# Altium project SWatch_1.PrjPcb
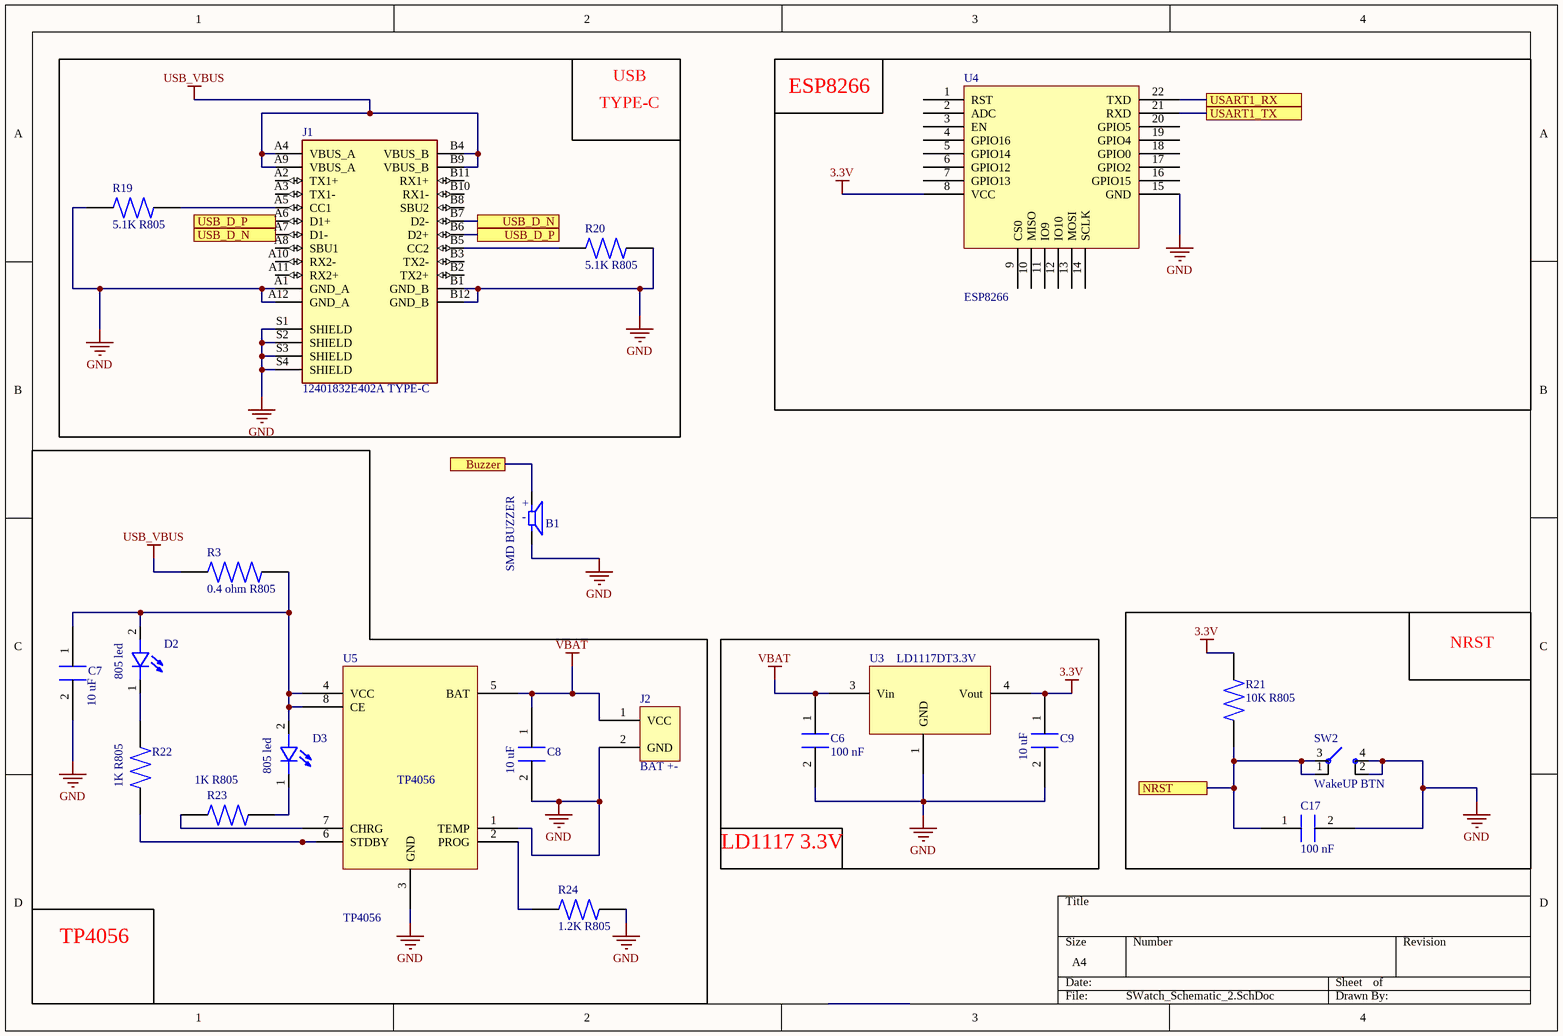
[diagram p0: SWatch_Schematic_2.SchDoc]
2 sheets, 57 parts. Net scope: flat (ports and power ports of the same name join across sheets).
Board file: PCB_SWatch_VER1.PcbDoc
Sheets:
  SWatch_Schematic_2.SchDoc
  SWatch_Schematic_1.SchDoc

## Sheet SWatch_Schematic_2.SchDoc
size A4

### Parts
B1  SMD BUZZER  [SMD BUZZER]
C6  100 nF  [100 nF C805]
C7  10 uF  [10uF C805]
C8  10 uF  [10uF C805]
C9  10 uF  [10uF C805]
C17  100 nF  [100 nF C805]
D2  805 led  [led]
D3  805 led  [led]
J1  12401832E402A TYPE-C  [12401832E402A TYPE-C]
J2  BAT +-  [BAT -+]
R3  0.4 ohm R805  [1K R805]
R19  5.1K R805  [1K R805]
R20  5.1K R805  [1K R805]
R21  10K R805  [10K R805]
R22  1K R805  [1K R805]
R23  1K R805  [1K R805]
R24  1.2K R805  [1.2K R805]
SW2  WakeUP BTN  [WakeUp BTN]
U3  LD1117DT3.3V  [LD1117DT3.3V]
U4  ESP8266  [ESP8266]
U5  TP4056  [TP4056]

### Blocks framed on the sheet
ESP8266: U4
TP4056: C7 C8 D2 D3 J2 R3 R22-R24 U5
NRST: C17 R21 SW2
LD1117 3.3V: C6 C9 U3

### Ports
  Buzzer, NRST, USART1_RX, USART1_TX, USB_D_N, USB_D_P

### Nets
3.3V: C9.1 R21.1 U3.4(Vout) U4.8(VCC)
GND: B1.2(N) C6.2 C7.2 C8.2 C9.2 C17.2 J1.A1(GND_A) J1.A12(GND_A) J1.B1(GND_B) J1.B12(GND_B) J1.S1(SHIELD) J1.S2(SHIELD) J1.S3(SHIELD) J1.S4(SHIELD) J2.2(GND) R19.1 R20.2 R24.2 SW2.2 SW2.4 U3.1(GND) U4.15(GND) U5.1(TEMP) U5.3(GND)
USB_VBUS: J1.A4(VBUS_A) J1.A9(VBUS_A) J1.B4(VBUS_B) J1.B9(VBUS_B) R3.2
VBAT: C6.1 C8.1 J2.1(VCC) U3.3(Vin) U5.5(BAT)
NetB1_1: B1.1(P) ; port   Buzzer
NetC7_1: C7.1 D2.2(A) D3.2(A) R3.1 U5.4(VCC) U5.8(CE)
NetC17_1: C17.1 R21.2 SW2.1 SW2.3 ; port NRST
NetD2_1: D2.1(C) R22.2
NetD3_1: D3.1(C) R23.2
NetJ1_A5: J1.A5(CC1) R19.2
NetJ1_A6: J1.A6(D1+) J1.B6(D2+) ; port USB_D_P
NetJ1_A7: J1.A7(D1-) J1.B7(D2-) ; port USB_D_N
NetJ1_B5: J1.B5(CC2) R20.1
NetR2_1: U4.22(TXD) ; port USART1_RX
NetR4_1: U4.21(RXD) ; port USART1_TX
NetR22_1: R22.1 U5.6(STDBY)
NetR23_1: R23.1 U5.7(CHRG)
NetR24_1: R24.1 U5.2(PROG)

Not connected (* = marked no-connect by the designer): J1 A2(TX1+) A3(TX1-) A8(SBU1) A10(RX2-) A11(RX2+) B2(TX2+) B3(TX2-) B8(SBU2) B10(RX1-) B11(RX1+); U4 1(RST) 2(ADC) 3(EN) 4(GPIO16) 5(GPIO14) 6(GPIO12) 7(GPIO13) 9(CS0) 10(MISO) 11(IO9) 12(IO10) 13(MOSI) 14(SCLK) 16(GPIO15) 17(GPIO2) 18(GPIO0) 19(GPIO4) 20(GPIO5)

### Notes on the sheet
- TYPE-C
- USB
- (in symbol SMD BUZZER) +; -

### Library data of the parts
B1 = SMD BUZZER: PKMCS0909E4000-R1

## Sheet SWatch_Schematic_1.SchDoc
size A4
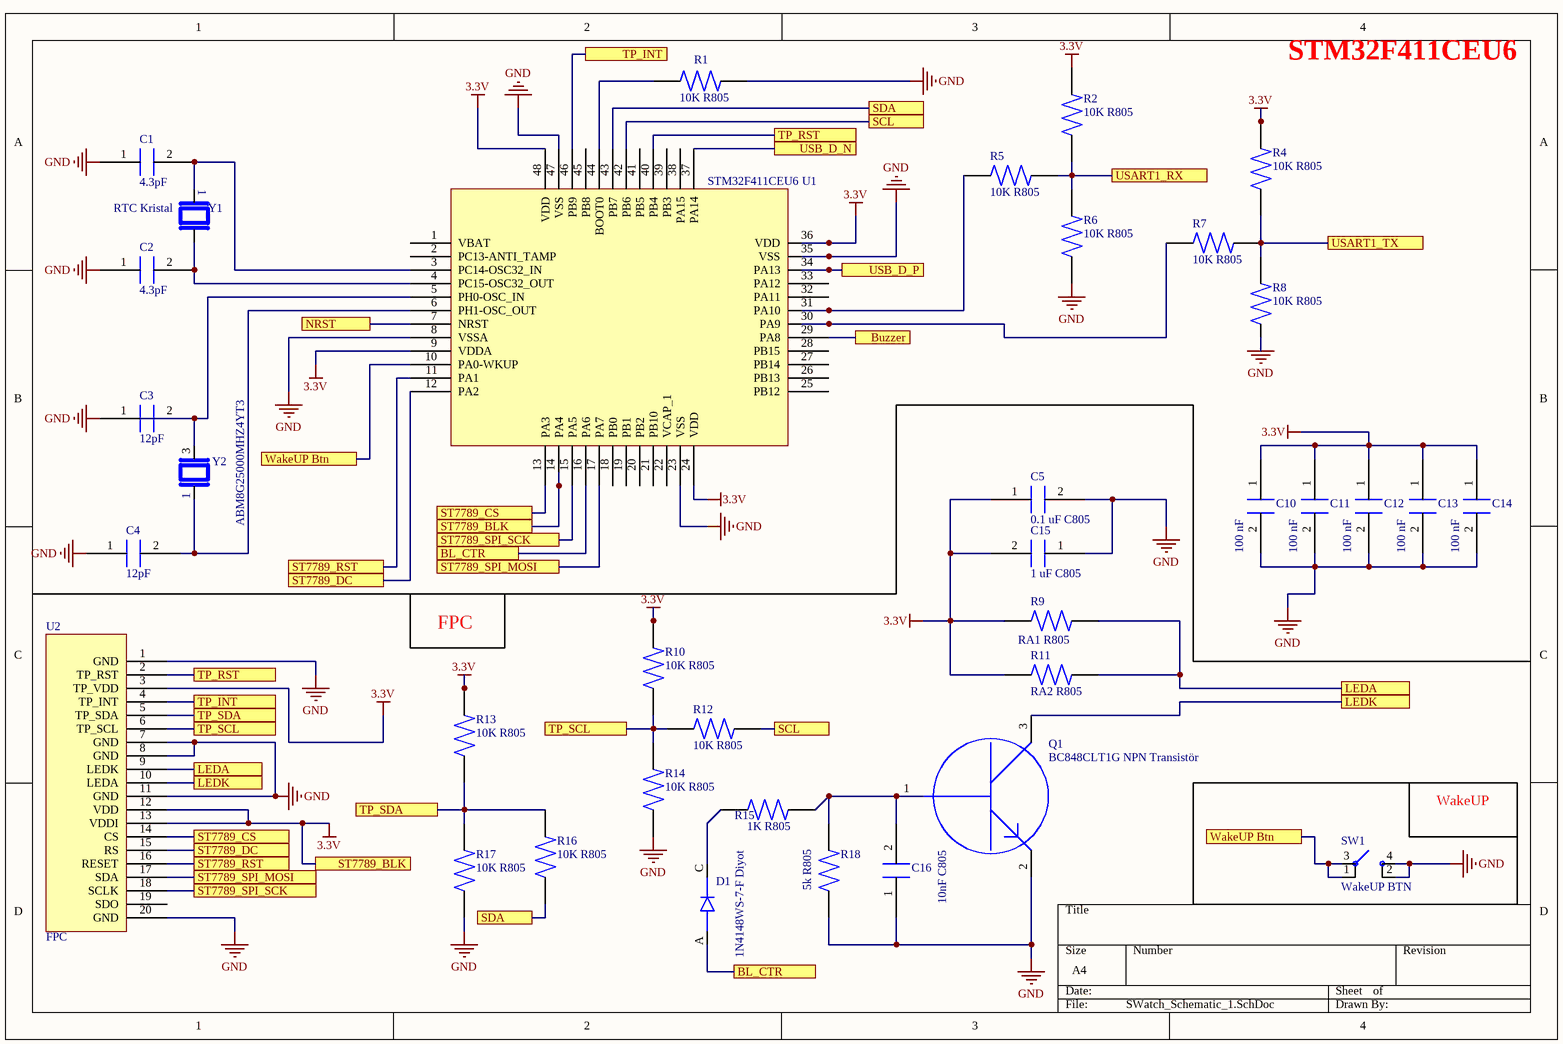
[diagram p1: SWatch_Schematic_1.SchDoc]

### Parts
C1  4.3pF  [4.3 pF C805]
C2  4.3pF  [4.3 pF C805]
C3  12pF  [12pF C805]
C4  12pF  [12pF C805]
C5  0.1 uF C805  [0.1 uF C805]
C10  100 nF  [100 nF C805]
C11  100 nF  [100 nF C805]
C12  100 nF  [100 nF C805]
C13  100 nF  [100 nF C805]
C14  100 nF  [100 nF C805]
C15  1 uF C805  [1 uF C805]
C16  10nF C805  [4.3 pF C805]
D1  1N4148WS-7-F Diyot  [1N4148WS-7-F Diyot]
Q1  BC848CLT1G NPN Transistör  [BC848CLT1G NPN Transistör]
R1  10K R805  [10K R805]
R2  10K R805  [10K R805]
R4  10K R805  [10K R805]
R5  10K R805  [10K R805]
R6  10K R805  [10K R805]
R7  10K R805  [10K R805]
R8  10K R805  [10K R805]
R9  RA1 R805  [1K R805]
R10  10K R805  [10K R805]
R11  RA2 R805  [1K R805]
R12  10K R805  [10K R805]
R13  10K R805  [10K R805]
R14  10K R805  [10K R805]
R15  1K R805  [1K R805]
R16  10K R805  [10K R805]
R17  10K R805  [10K R805]
R18  5k R805  [1.2K R805]
SW1  WakeUP BTN  [WakeUp BTN]
U1  STM32F411CEU6  [STM32F411CEU6]
U2  FPC  [FPC]
Y1  RTC Kristal  [32.768 KHZ RTC]
Y2  ABM8G25000MHZ4YT3  [ABM8G25000MHZ4YT3]

### Blocks framed on the sheet
WakeUP: SW1

### Ports
BL_CTR, Buzzer, LEDA, LEDK, NRST, SCL, SDA, ST7789_BLK, ST7789_CS, ST7789_DC, ST7789_RST, ST7789_SPI_MOSI, ST7789_SPI_SCK, TP_INT, TP_RST, TP_SCL, TP_SDA, USART1_RX, USART1_TX, USB_D_N, USB_D_P, WakeUP Btn

### Nets
3.3V: C5.1 C10.1 C11.1 C12.1 C13.1 C14.1 C15.2 R2.2 R4.2 R9.1 R10.2 R11.1 R13.2 U1.9(VDDA) U1.14(PA4) U1.24(VDD) U1.36(VDD) U1.48(VDD) U2.3(TP_VDD) U2.12(VDD) U2.13(VDDI) ; port ST7789_BLK
GND: C1.1 C2.1 C3.1 C4.1 C5.2 C10.2 C11.2 C12.2 C13.2 C14.2 C15.1 C16.1 Q1.2 R1.2 R6.1 R8.1 R14.1 R17.1 R18.1 SW1.2 SW1.4 U1.8(VSSA) U1.23(VSS) U1.35(VSS) U1.47(VSS) U2.1(GND) U2.7(GND) U2.8(GND) U2.11(GND) U2.20(GND)
NetB1_1: U1.29(PA8) ; port Buzzer
NetC1_2: C1.2 U1.3(PC14-OSC32_IN) Y1.1
NetC2_2: C2.2 U1.4(PC15-OSC32_OUT) Y1.2
NetC3_2: C3.2 U1.5(PH0-OSC_IN) Y2.3
NetC4_2: C4.2 U1.6(PH1-OSC_OUT) Y2.1
NetC16_2: C16.2 Q1.1 R15.2 R18.2
NetC17_1: U1.7(NRST) ; port NRST
NetD1_A: D1.A U1.16(PA6) ; port BL_CTR
NetD1_C: D1.C R15.1
NetJ1_A6: U1.34(PA13) ; port USB_D_P
NetJ1_A7: U1.37(PA14) ; port USB_D_N
NetQ1_3: Q1.3 U2.10(LEDA) ; port LEDK
NetR1_1: R1.1 U1.44(BOOT0)
NetR2_1: R2.1 R5.1 R6.2 ; port USART1_RX
NetR4_1: R4.1 R7.1 R8.2 ; port USART1_TX
NetR5_2: R5.2 U1.31(PA10)
NetR7_2: R7.2 U1.30(PA9)
NetR9_2: R9.2 R11.2 U2.9(LEDK) ; port LEDA
NetR10_1: R10.1 R12.2 R14.2 U2.6(TP_SCL) ; port TP_SCL
NetR12_1: R12.1 U1.42(PB6) ; port SCL
NetR13_1: R13.1 R16.2 R17.2 U2.5(TP_SDA) ; port TP_SDA
NetR16_1: R16.1 U1.43(PB7) ; port SDA
NetSW1_1: SW1.1 SW1.3 U1.10(PA0-WKUP) ; port WakeUP Btn
NetU1_11: U1.11(PA1) U2.16(RESET) ; port ST7789_RST
NetU1_12: U1.12(PA2) U2.15(RS) ; port ST7789_DC
NetU1_13: U1.13(PA3) U2.14(CS) ; port ST7789_CS
NetU1_15: U1.15(PA5) U2.18(SCLK) ; port ST7789_SPI_SCK
NetU1_17: U1.17(PA7) U2.17(SDA) ; port ST7789_SPI_MOSI
NetU1_40: U1.40(PB4) U2.2(TP_RST) ; port TP_RST
NetU1_46: U1.46(PB9) U2.4(TP_INT) ; port TP_INT

Not connected (* = marked no-connect by the designer): U1 1(VBAT) 2(PC13-ANTI_TAMP) 18(PB0) 19(PB1) 20(PB2) 21(PB10) 22(VCAP_1) 25(PB12) 26(PB13) 27(PB14) 28(PB15) 32(PA11) 33(PA12) 38(PA15) 39(PB3) 41(PB5) 45(PB8); U2 19(SDO)

### Notes on the sheet
- STM32F411CEU6
- FPC

## Nets that join several sheets
3.3V: SWatch_Schematic_2 (C9.1 R21.1 U3.4 U4.8), SWatch_Schematic_1 (21 pins)
GND: SWatch_Schematic_2 (24 pins), SWatch_Schematic_1 (30 pins)
NetB1_1: SWatch_Schematic_2 (B1.1), SWatch_Schematic_1 (U1.29)
NetC17_1: SWatch_Schematic_2 (C17.1 R21.2 SW2.1 SW2.3), SWatch_Schematic_1 (U1.7)
NetJ1_A6: SWatch_Schematic_2 (J1.A6 J1.B6), SWatch_Schematic_1 (U1.34)
NetJ1_A7: SWatch_Schematic_2 (J1.A7 J1.B7), SWatch_Schematic_1 (U1.37)
NetR2_1: SWatch_Schematic_2 (U4.22), SWatch_Schematic_1 (R2.1 R5.1 R6.2)
NetR4_1: SWatch_Schematic_2 (U4.21), SWatch_Schematic_1 (R4.1 R7.1 R8.2)